# Altium schematic sheet FTDI.SchDoc
size A4; DocumentNumber: 24; SheetNumber: 24; SheetTotal: 27
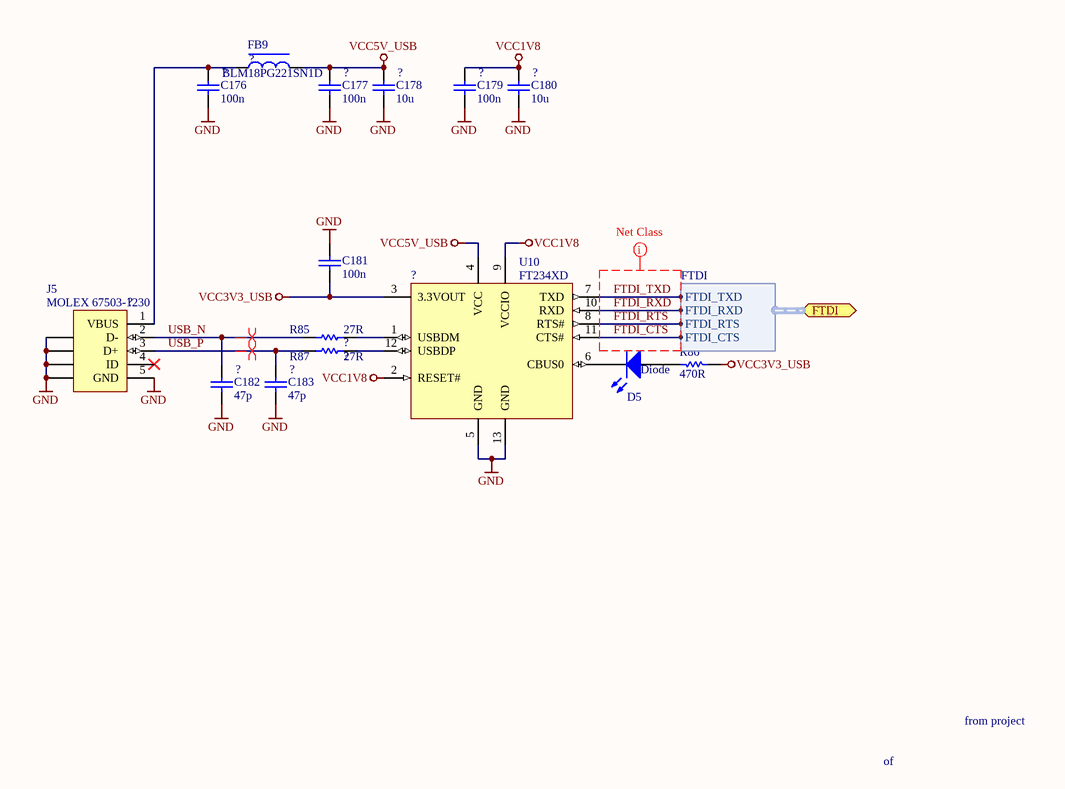
[diagram p0: FTDI.SchDoc]

## Parts
C176  100n  [CAPC1005L]
C177  100n  [CAPC1005L]
C178  10u  [CAPC1005L]
C179  100n  [CAPC1005L]
C180  10u  [CAPC1005L]
C181  100n  [CAPC1005L]
C182  47p  [CAPC1005L]
C183  47p  [CAPC1005L]
D5  SN_CATEGORY: Diode  [0603D]  (hidden comment: LED RED)
FB9  BLM18PG221SN1D  [INDC1608L]
J5  MOLEX 67503-1230  [67503-1230]
R85  27R  [RESC1005L]
R86  470R  [RESC1005L]
R87  27R  [RESC1005L]
U10  FT234XD  [DFN-12_V]

## Ports
FTDI (harness FTDI)

## Harnesses
FTDI: FTDI_TXD, FTDI_RXD, FTDI_RTS, FTDI_CTS

## Nets
GND: C176.2 C177.2 C178.2 C179.2 C180.2 C181.1 C182.2 C183.2 J5.5(GND) J5.MH1 J5.MH2 J5.MH3 J5.MH4 U10.5(GND) U10.13(GND)
VCC1V8: C179.1 C180.1 U10.2(RESET#) U10.9(VCCIO)
VCC3V3_USB: C181.2 R86.1 U10.3(3.3VOUT)
VCC5V_USB: C177.1 C178.1 FB9.2 U10.4(VCC)
FTDI_CTS: U10.11(CTS#) ; port FTDI.FTDI_CTS
FTDI_RTS: U10.8(RTS#) ; port FTDI.FTDI_RTS
FTDI_RXD: U10.10(RXD) ; port FTDI.FTDI_RXD
FTDI_TXD: U10.7(TXD) ; port FTDI.FTDI_TXD
USB_N: C182.1 J5.2(D-) R85.2
USB_P: C183.1 J5.3(D+) R87.2
NetC176_1: C176.1 FB9.1 J5.1(VBUS)
NetD5_1: D5.1(A) R86.2
NetD5_2: D5.2(K) U10.6(CBUS0)
NetR85_1: R85.1 U10.1(USBDM)
NetR87_1: R87.1 U10.12(USBDP)

Not connected (* = marked no-connect by the designer): J5 4(ID)*

## Layout directives
differential pair: USB_N, USB_P
net class FTDI: FTDI_CTS, FTDI_RTS, FTDI_RXD, FTDI_TXD

## Notes on the sheet
- from project
- of

## Library data of the parts
C176-C183 = Cap: Capacitor; Manufacturer: Generic Components; Class: Passive; Published: 08/06/2000; Publisher: Altium Hobart Technology Centre; SubClass: Capacitor; SN_CATEGORY: ?
D5 = LED3: Typical RED, GREEN, YELLOW, AMBER GaAs LED; Manufacturer: Generic Components; Class: Optoelectronic; Published: 08/06/2000; Publisher: Altium Hobart Technology Centre; SubClass: LED
FB9 = INDUCTOR2: Ferrite Bead; SN_CATEGORY: ?
J5 = mini_usb: USB On-The-Go (OTG) Mini-B Receptacle, Surface Mount, Right Angle, Solder Tabs without Back Cover and PCB Locator Pegs, Lead-Free; ContactMaterial: Copper Alloy; ContactPlating: Gold (30); PCB_Layout: Complies with manufacturer's recommendation.; DrillSize: Corresponds to nominal value.; Published: 15-Jul-2004; DatasheetDocument: 11-Jan-2004; PackageDocument: 11-Jan-2004; PackageReference: 1364275; Publisher: Altium Limited; HousingMaterial: 6T Nylon; PanelGround: Without; ComponentLink1Description: Manufacturer Link; ComponentLink1URL: http://www.tycoelectronics.com/; ComponentLink2Description: Packaging Specification; ComponentLink2URL: http://ecommas.tycoelectronics.com/commerce/DocumentDelivery/DDEController?Action=showdoc&DocId=Customer+Drawing%7F1364275%7FB%7Ftif%7FEnglish%7FENG_CD_1364275_B.tif; SN_CATEGORY: ?
R85-R87 = Res1: Resistor; Manufacturer: Generic Components; Class: Passive; Published: 08/06/2000; Publisher: Altium Hobart Technology Centre; SubClass: Resistor; SN_CATEGORY: ?
U10 = FT234XD-T: FT234XD USB to BASIC UART IC, -40 to +85 degC, 12-Pin DFN, Pb-Free, Tray; Manufacturer: FTDI; DatasheetVersion: ver 1.1, Feb-2013; PackageVersion: Feb-13; PackageReference: DFN-12; PackageDescription: 12-Pin Dual Flat No-Lead, 3 x 3 mm Body, 0.45 mm Pitch, Exposed Pad; PartNumber: FT234XD-T; ComponentLink1Description: Manufacturer URL; ComponentLink1URL: http://www.ftdichip.com/; ComponentLink2Description: Datasheet; ComponentLink2URL: http://www.ftdichip.com/Support/Documents/DataSheets/ICs/DS_FT234XD.pdf; SN_CATEGORY: ?